# EAGLE design Lampen (EAGLE 9.5.1)
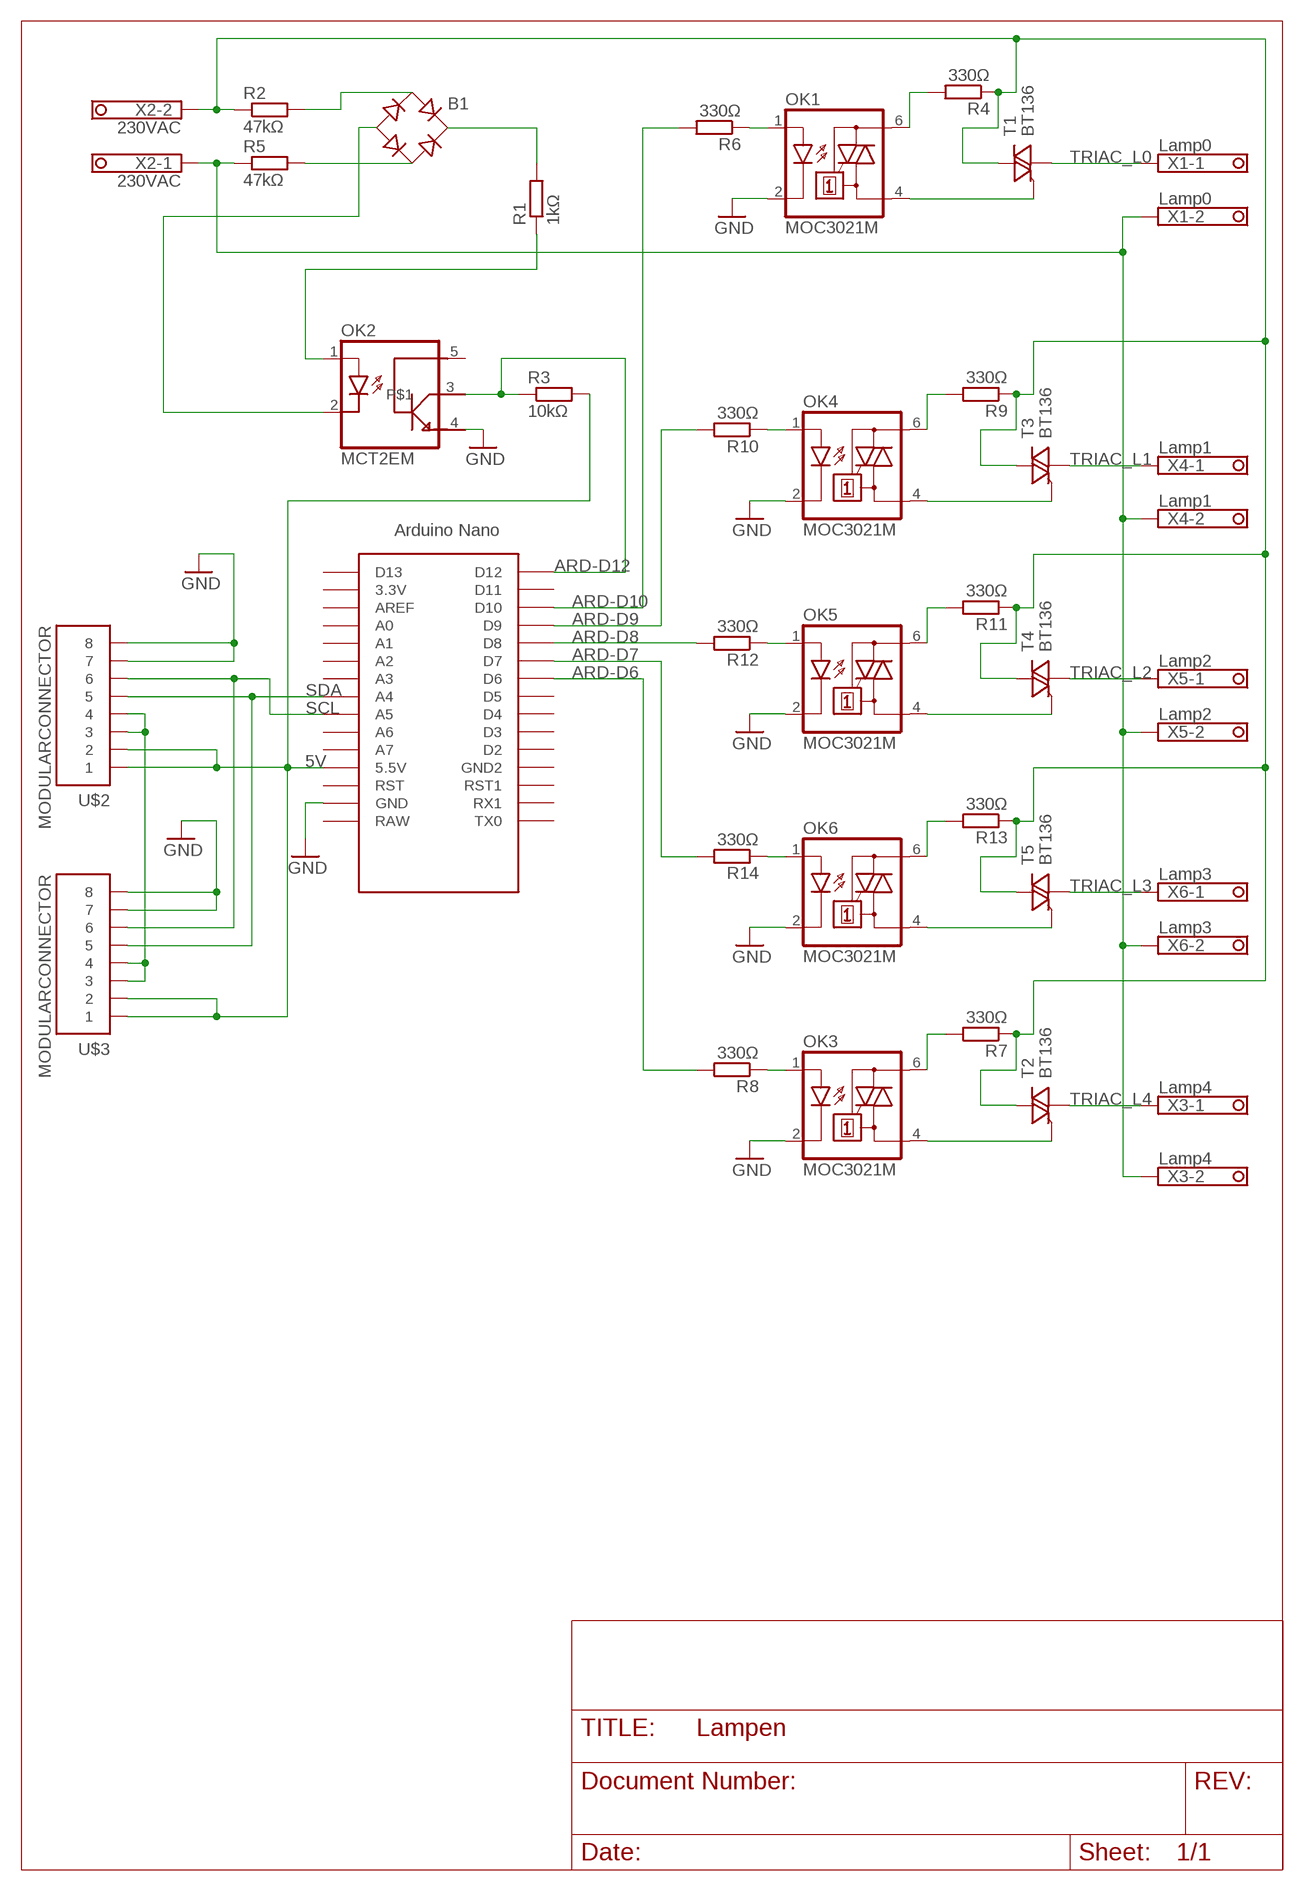
[diagram p0: schematic, sheet 1]

## Parts
B1  B250C1500G  [RB1A]
OK1  MOC3021M  MOC3021M10  [DIL06]
OK2  MCT2EM  MCT2EM21  [DIL06]
OK3  MOC3021M  MOC3021M10  [DIL06]
OK4  MOC3021M  MOC3021M10  [DIL06]
OK5  MOC3021M  MOC3021M10  [DIL06]
OK6  MOC3021M  MOC3021M10  [DIL06]
R1  1kΩ  R-EU_M1206  [M1206]
R2  47kΩ  R-EU_R2512  [R2512]
R3  10kΩ  R-EU_M1206  [M1206]
R4  330Ω  R-EU_M1206  [M1206]
R5  47kΩ  R-EU_R2512  [R2512]
R6  330Ω  R-EU_M1206  [M1206]
R7  330Ω  R-EU_M1206  [M1206]
R8  330Ω  R-EU_M1206  [M1206]
R9  330Ω  R-EU_M1206  [M1206]
R10  330Ω  R-EU_M1206  [M1206]
R11  330Ω  R-EU_M1206  [M1206]
R12  330Ω  R-EU_M1206  [M1206]
R13  330Ω  R-EU_M1206  [M1206]
R14  330Ω  R-EU_M1206  [M1206]
T1  BT136  [TO220DS]
T2  BT136  [TO220DS]
T3  BT136  [TO220DS]
T4  BT136  [TO220DS]
T5  BT136  [TO220DS]
U$1  NANO  [NANO]
U$2  MODULARCONNECTOR  [MA04-2]
U$3  MODULARCONNECTOR  [MA04-2]
X1  Lamp0  1751248  [1751248]
X2  230VAC  1751248  [1751248]
X3  Lamp4  1751248  [1751248]
X4  Lamp1  1751248  [1751248]
X5  Lamp2  1751248  [1751248]
X6  Lamp3  1751248  [1751248]

## Nets
3.3V: U$2.3 U$2.4 U$3.3 U$3.4
5V: R3.2 U$1.5V(5.5V) U$2.1 U$2.2 U$3.1 U$3.2
230VL: R2.1 R4.1 R7.1 R9.1 R11.1 R13.1 T1.A2 T2.A2 T3.A2 T4.A2 T5.A2 X2.2
230VN: R5.1 X1.2 X2.1 X3.2 X4.2 X5.2 X6.2
ARD-D6: R8.2 U$1.D6
ARD-D7: R14.2 U$1.D7
ARD-D8: R12.2 U$1.D8
ARD-D9: R10.2 U$1.D9
ARD-D10: R6.2 U$1.D10
ARD-D12: OK2.3 R3.1 U$1.D12
GND: OK1.2(C) OK2.4(A1) OK3.2(C) OK4.2(C) OK5.2(C) OK6.2(C) U$1.GND U$2.7 U$2.8 U$3.7 U$3.8
N$1: B1.AC2 R5.2
N$3: B1.+ R1.2
N$4: OK2.1(A) R1.1
N$5: B1.AC1 R2.2
N$6: OK1.1(A) R6.1
N$7: B1.- OK2.2(C)
N$10: OK1.4(A1) T1.G
N$13: OK1.6(A2) R4.2
N$15: OK4.4(A1) T3.G
N$16: OK3.4(A1) T2.G
N$19: OK3.6(A2) R7.2
N$20: OK3.1(A) R8.1
N$24: OK4.6(A2) R9.2
N$25: OK4.1(A) R10.1
N$27: OK5.4(A1) T4.G
N$30: OK5.6(A2) R11.2
N$31: OK5.1(A) R12.1
N$33: OK6.4(A1) T5.G
N$36: OK6.6(A2) R13.2
N$37: OK6.1(A) R14.1
SCL: U$1.A5 U$2.6 U$3.6
SDA: U$1.A4 U$2.5 U$3.5
TRIAC_L0: T1.A1 X1.1
TRIAC_L1: T3.A1 X4.1
TRIAC_L2: T4.A1 X5.1
TRIAC_L3: T5.A1 X6.1
TRIAC_L4: T2.A1 X3.1
Unconnected: OK2.5(A2) U$1.3.3V U$1.A0 U$1.A1 U$1.A2 U$1.A3 U$1.A6 U$1.A7 U$1.AREF U$1.D2 U$1.D3 U$1.D4 U$1.D5 U$1.D11 U$1.D13 U$1.GND1(GND2) U$1.ICSP1 U$1.ICSP2 U$1.ICSP3 U$1.ICSP4 U$1.ICSP5 U$1.ICSP6 U$1.RAW U$1.RST U$1.RST1 U$1.RX1 U$1.TX0

## Library data of the parts
B1 = dimmer_lampen:B250C1500G: RECTIFIER 1 A
OK1 OK3-OK6 = dimmer_lampen:MOC3021M: RANDOM-PHASE OPTOISOLATORS TRIAC DRIVER OUTPUT Source: http://www.fairchildsemi.com MOC3020-M.pdf; MF: FAIRCHILD SEMICONDUCTOR; MPN: MOC3010-M; OC_FARNELL: 1505423; OC_NEWARK: 72K8892
OK2 = dimmer_lampen2:MCT2EM: RANDOM-PHASE OPTOISOLATORS TRIAC DRIVER OUTPUT; MF: FAIRCHILD SEMICONDUCTOR; MPN: MOC3021-M; OC_FARNELL: 1021365; OC_NEWARK: 95B7895
R1-R14 = rcl:R-EU_: RESISTOR, European symbol; SPICEPREFIX: R
T1-T5 = dimmer_lampen:BT136: TRIAC
U$1 = Arduino-clone:NANO: Arduino Nano
U$2 U$3 = Main_lib:MODULARCONNECTOR
X1-X6 = dimmer_lampen:1751248: MKDS 1/ 2-3,5 Printklemme Nennstrom: 10 A Bemessungsspannung: 160 V Raster: 3,5 mm Polzahl: 2 Montageart: Löten Anschlussart: Schraubanschluss Anschlussrichtung vom Leiter zur Platine: 0° Source: http://eshop.phoenixcontact.com .. 1751248.pdf

## Board
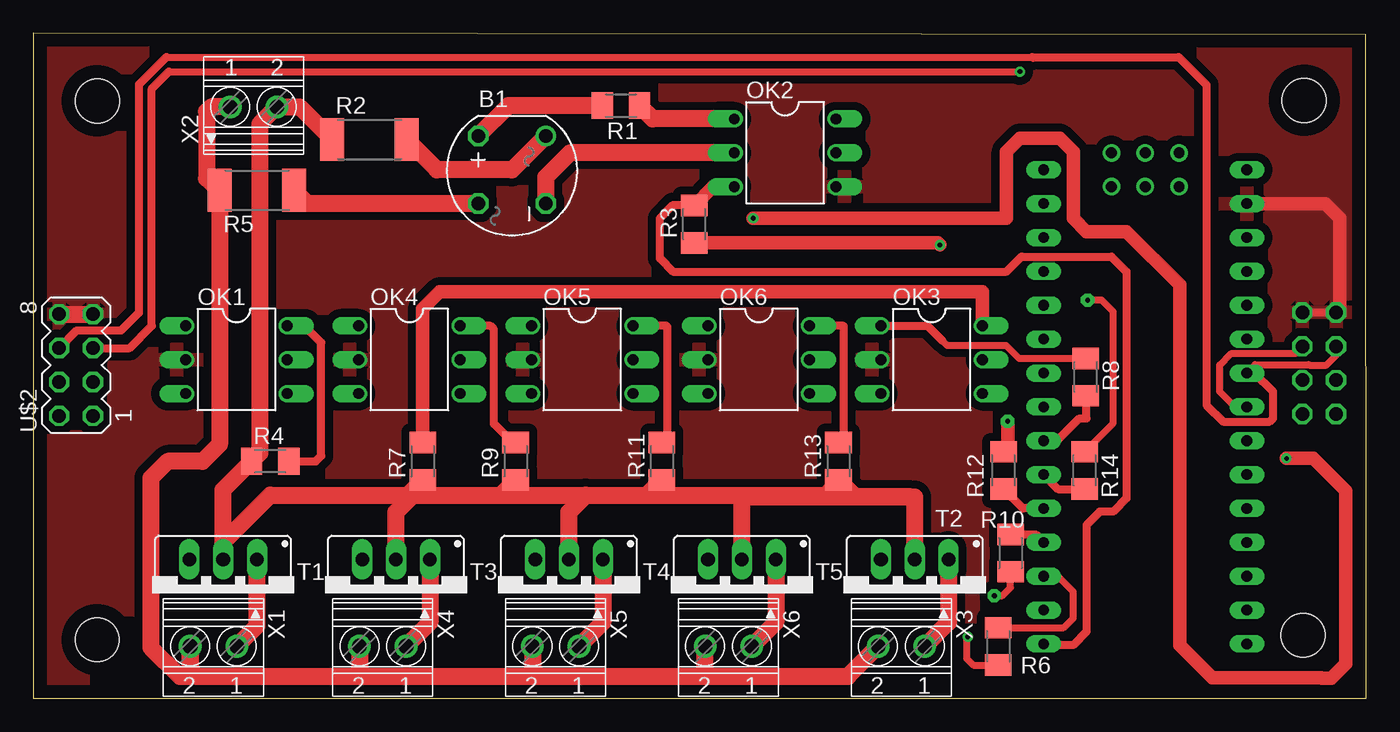
[diagram p1: board, top side]
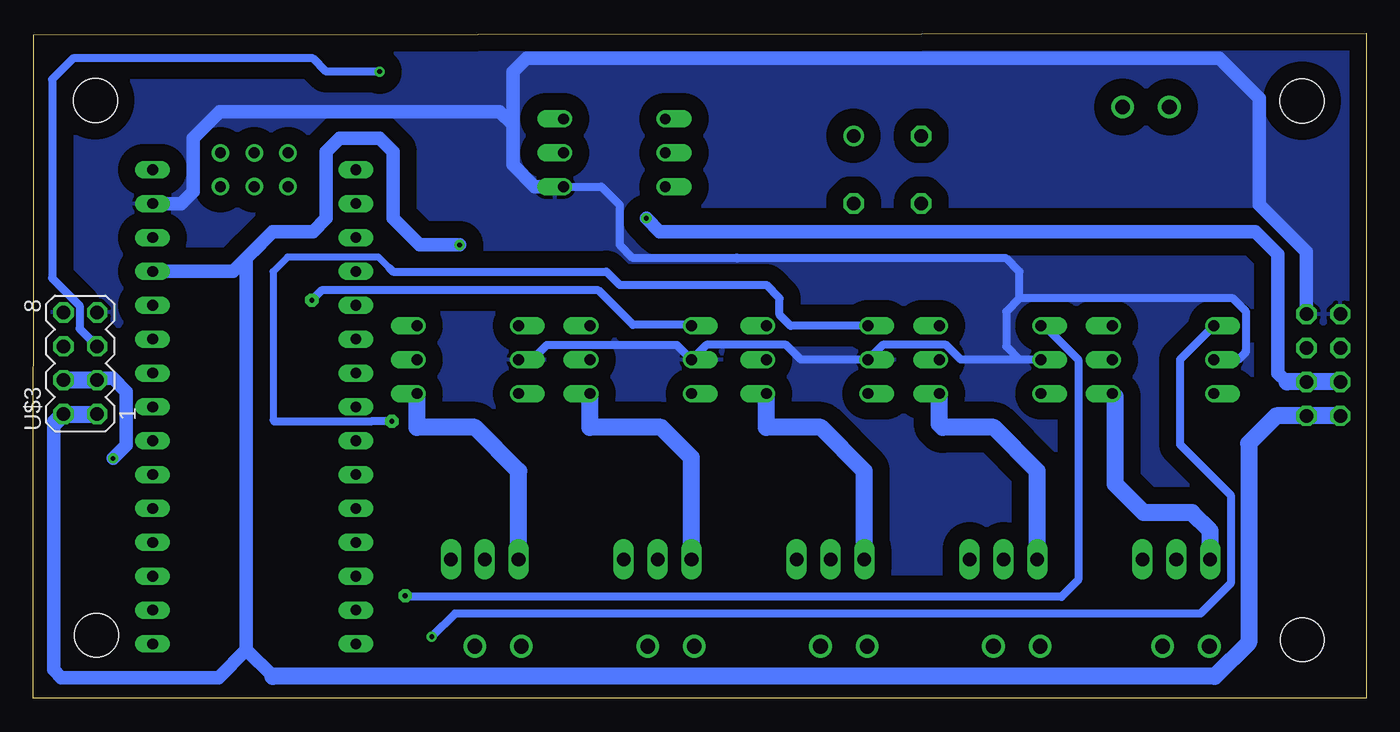
[diagram p2: board, bottom side, seen from below]

Size 99.98 x 49.87 mm. Coordinates in mm from the lower left corner, seen from the top.
Outline: 0,0 99.98,0 99.95,49.77 0,49.87 0,0
Copper layers (1+16): Top 0.035mm / dielectric 1.5mm / Bottom 0.035mm
Design rules "default *": minimum track width 6mil, minimum drill 0.35mm, track to track 6mil, track to pad 6mil, pad to pad 6mil, via to via 6mil, smd to smd 6mil, copper to edge 40mil, drill to drill 6mil, minimum pad ring 10mil, minimum via ring 8mil, stop-mask expansion 4mil, vias tented up to drill 0mil, thermal gap 10mil
Holes 3.3 mm at 4.81,44.8 4.8,4.4 95.23,4.74 95.33,44.84

### Footprints (pad centres in the part's own frame; a part is rotated, then mirrored left to right if it is on the bottom)
RB1A = drill 1.016 octagon: + -2.54,-2.54; - 2.54,2.54; AC2 2.54,-2.54 | drill 1.016: AC1 -2.54,2.54
DIL06 = drill 0.813 offset: 1 -2.54,-3.81; 2 0,-3.81; 3 2.54,-3.81; 4 2.54,3.81; 5 0,3.81; 6 -2.54,3.81
M1206 = smd 1.6 x 2: 1 -1.4,0; 2 1.4,0
R2512 = smd 1.8 x 3.2: 1 -2.8,0; 2 2.8,0
TO220DS = drill 1.016 long: A1 -2.54,-2.54; A2 0,-2.54; G 2.54,-2.54
NANO = drill 0.8 long: 3.3V -10.16,24.13; 5V -10.16,-1.27; A0 -10.16,19.05; A1 -10.16,16.51; A2 -10.16,13.97; A3 -10.16,11.43; A4 -10.16,8.89; A5 -10.16,6.35; A6 -10.16,3.81; A7 -10.16,1.27; AREF -10.16,21.59; D2 5.08,1.27; D3 5.08,3.81; D4 5.08,6.35; D5 5.08,8.89; D6 5.08,11.43; D7 5.08,13.97; D8 5.08,16.51; D9 5.08,19.05; D10 5.08,21.59; D11 5.08,24.13; D12 5.08,26.67; D13 -10.16,26.67; GND -10.16,-6.35; GND1 5.08,-1.27; RAW -10.16,-8.89; RST -10.16,-3.81; RST1 5.08,-3.81; RX1 5.08,-6.35; TX0 5.08,-8.89 | drill 0.8: ICSP1 -5.08,-10.16; ICSP2 -5.08,-7.62; ICSP3 -2.54,-10.16; ICSP4 -2.54,-7.62; ICSP5 0,-10.16; ICSP6 0,-7.62
MA04-2 = drill 1.016 octagon: 1 -3.81,-1.27; 2 -3.81,1.27; 3 -1.27,-1.27; 4 -1.27,1.27; 5 1.27,-1.27; 6 1.27,1.27; 7 3.81,-1.27; 8 3.81,1.27
1751248 = drill 1.1 pad 1.7: 1 -1.75,-0.1; 2 1.75,-0.1

### Placement (x,y rotation side)
B1  35.91,39.64 270 top
OK1  15.24,25.4 270 top
OK2  56.39,40.91 270 top
OK3  67.39,25.4 270 top
OK4  28.21,25.4 270 top
OK5  41.18,25.4 270 top
OK6  54.42,25.4 270 top
R1  44.07,44.45 180 top
R2  25.21,41.91 0 top
R3  49.58,35.56 270 top
R4  17.78,17.78 0 top
R5  16.78,38.1 0 top
R6  72.38,3.9 90 top
R7  29.21,17.78 90 top
R8  78.94,24.1 270 top
R9  36.18,17.78 90 top
R10  73.3,10.9 90 top
R11  47.15,17.78 90 top
R12  72.78,17.1 270 top
R13  60.39,17.78 90 top
R14  78.86,17.1 270 top
T1  14.24,7.89 180 top
T2  66.12,7.89 180 top
T3  27.21,7.89 180 top
T4  40.18,7.89 180 top
T5  53.15,7.89 180 top
U$1  80.87,30.75 180 top
U$2  3.21,25 90 top
U$3  96.46,25.13 90 bottom
X1  13.51,3.81 180 top
X2  16.51,44.45 0 top
X3  65.12,3.81 180 top
X4  26.21,3.81 180 top
X5  39.18,3.81 180 top
X6  52.15,3.81 180 top

### Tracks (layer width: path | path; a pad name or v marks a point on that pad's centre or on a via)
3.3V  (via drill 0.35)
  Top 1: 88.45,1.55 96.6,1.55 96.63,1.52 97.37,1.52 98.46,2.61 98.46,6.24 98.45,15.54 98.4,15.6
  Top 1.016: v54,36 73,36 73,41 74,42 77,42 78,41 78,36 79,35 82,35 86,31 86,4 88.45,1.55 | 98.4,15.6 96,18 v94,18
  Bottom 1.016: 5.95,23.73 6.62,24.4 6.62,33.29 8.33,35 53,35 v54,36 | v94,18 93,19 93,23 94,24 95.05,24 U$3.3
  Bottom 1.27: U$2.4 U$2.3 5.95,23.73 | U$3.3 U$3.4
5V  (via drill 0.35)
  Top 0.61: 49.45,34.29 R3.2
  Top 1.016: 50.11,34.16 R3.2 67.84,34.16 v68,34
  Bottom 0.61: 83,34.02 82.98,34.02
  Bottom 1: 84,3.65 86.09,1.56 97.89,1.56 97.89,1.57 98.46,2.13 98.45,20.45 97.73,21.18 U$3.2
  Bottom 1.016: 82,1.65 84,3.65 84,33 82.98,34.02 | U$1.5V 85,32.02 83,34.02 82.02,35 79,35 78,36 78,41 77,42 74,42 73,41 73,36 71,34 v68,34
  Bottom 1.27: U$2.2 U$2.1 6.75,21.19 8.82,19.12 8.82,4.19 11.36,1.65 82,1.65 | 98.32,20.73 U$3.2 U$3.1
230VL
  Top 1.016: R13.1 59.69,15.68 59.69,15.11
  Top 1.27: R2.1 19.97,44.35 X2.2 16.99,43.08 16.99,18.39 R4.1 14.24,15.64 T1.A2 14.24,11.7 17.78,15.24 28.07,15.24 | R7.1 28.07,15.24 | 28.07,15.24 28.48,15.24 | 59.69,15.11 53.42,15.11 53.15,14.84 T5.A2 | 59.69,15.11 66.12,15.11 T2.A2 | R13.1 61.66,15.11 65.85,15.11 | T3.A2 27.21,13.97 28.48,15.24 | 28.48,15.24 35.04,15.24 | 35.04,15.24 R9.1 | 35.04,15.24 41.45,15.24 | 41.45,15.24 46.01,15.24 | 46.01,15.24 59.56,15.24 59.69,15.11 | 46.01,15.24 R11.1 | T4.A2 40.18,13.97 41.45,15.24
230VN
  Top 1.27: 24.46,1.65 12.24,1.65 11.76,2.13 X1.2 11.76,1.65 10.98,1.65 8.82,3.81 8.82,16.51 10.09,17.78 12.7,17.78 13.97,19.05 R5.1 | X4.2 24.46,1.65 | 37.91,1.65 37.43,2.13 X5.2 | 50.4,1.65 61.11,1.65 X3.2 | 50.4,1.65 X6.2 | R5.1 | X2.1 13.35,44.35 13,44 13,39 13.91,38.09 R5.1 | 37.91,1.65 50.4,1.65 | 24.46,1.65 37.91,1.65
ARD-D6
  Top 0.61: U$1.D6 76.79,19.32 78.47,21 79,21 79,22.64 R8.2
ARD-D7
  Top 0.61: U$1.D7 76.87,15.7 R14.2
ARD-D8
  Top 0.61: U$1.D8 74.24,14.24 R12.2
ARD-D9
  Top 0.61: R10.2 75.19,12.3 U$1.D9
ARD-D10
  Top 0.508: R6.2 77.3,5.3 78,6 78,8 76.84,9.16 U$1.D10
ARD-D12
  Top 0.61: R3.1 49.54,37 48,37 47,36 47,33 48,32 73,32 74.13,33.13 80.87,33.13 82,32 82,15 81,14 80,14 79,13 79,5 78,4 75.87,4 U$1.D12
  Top 1.016: OK2.3 50.99,38.37 R3.1
GND
  Top 0.61: U$3.7 U$3.8
  Top 1.016: U$3.8 98,29.21 98,36 96.9,37.1 U$1.GND
  Top 1.27: U$2.8 U$2.7
  Bottom 0.61: OK4.2 26,25.4 | 26,25.4 30.4,25.4 31.52,26.52 36.25,26.52 OK5.2 42.4,25.4 43.52,26.52 49.49,26.52 OK6.2 51.73,26.52 61.46,26.52 62.58,25.4 OK3.2 | OK1.2 9.6,25.4 8.99,26.01 8.99,28.99 10,30 26,30 | 26,30 27,29 27,26.4 26,25.4 | 26,30 26,32 27,33 47.16,33 47.21,33.05 55.05,33.05 56,34 56,37 57.37,38.37 OK2.4 60.2,38.2
  Bottom 1.016: U$2.7 4.48,33.48 8,37 8,45 11,48 63,48 64,47 64,43 | OK2.4 62.37,38.37 64,40 64,43 | U$1.GND 88.9,37.1 88,38 88,42 86,44 65,44 64,43
  pour Bottom (isolate 1.27): 0,49.53 100,49.53 100,0 0,0
  pour Top (isolate 0.61): 0,49.53 100,49.53 100,0 0,0
N$1
  Top 1.27: B1.AC2 20.58,37.1 R5.2
N$3
  Top 1.27: R1.2 35.64,44.45 B1.+
N$4
  Top 1.27: OK2.1 46.47,43.45 R1.1
N$5
  Top 1.27: R2.2 30.28,39.64 35.91,39.64 B1.AC1
N$6  (via drill 0.35)
  Top 0.508: v70.09,4.62 70,4.53 70,3 70.5,2.5 R6.1
  Bottom 0.61: OK1.1 13.97,25.4 13.97,19.05 10.16,15.24 10.16,8.62 12.43,6.35 68.36,6.35 v70.09,4.62
N$7
  Top 1.27: B1.- 38.45,39.1 40.26,40.91 OK2.2
N$10
  Bottom 1.27: T1.G 11.7,12.57 13.07,13.93 16.69,13.93 18.82,16.07 18.82,22.63 OK1.4
N$13
  Top 0.61: R4.2 21.18,17.78 21.59,18.19 21.59,26.67 20.32,27.94
  Top 1.016: 20.32,27.94 OK1.6
N$15
  Bottom 1.27: T3.G 24.67,17.05 27.94,20.32 31.75,20.32 32.02,20.59 OK4.4
N$16
  Bottom 1.27: T2.G 63.58,17.05 66.85,20.32 71.2,20.32 OK3.4
N$19
  Top 1.016: R7.2 29.21,29.21 30.48,30.48 71.2,30.48 OK3.6
N$20
  Top 0.508: R8.1 73.93,25.5 72.96,26.47 68.53,26.47 68.18,26.82
  Top 0.61: OK3.1 67.06,27.94 68.18,26.82
N$24
  Top 0.152: R9.2 36.05,19.05
  Top 0.61: OK4.6 34.29,27.94 34.56,27.67 34.56,20.59 35.97,19.18 R9.2
N$25  (via drill 0.35 pad 1)
  Top 0.508: v72.09,7.7 72.7,7.7 73.3,8.3 R10.1
  Bottom 0.61: OK4.1 24.13,27.94 21.59,25.4 21.59,8.89 22.86,7.62 72.09,7.62 v72.09,7.7
N$27
  Bottom 1.27: T4.G 37.64,17.05 40.91,20.32 44.99,20.32 OK5.4
N$30
  Top 0.61: R11.2 47.53,19.56 47.53,27.94 OK5.6
N$31  (via drill 0.35 pad 1)
  Top 1.016: R12.1 73.09,18.81 v73.09,20.78
  Bottom 0.508: 81.9,20.78 82,20.88 82,32 80.92,33.08 74.08,33.08 73.29,32.29
  Bottom 0.61: OK5.1 43.18,27.94 44,28.76 44,30 45,31 56,31 57,32 73,32 73.29,32.29 | v73.09,20.78 74.64,20.78 74.68,20.75 81.87,20.75 81.9,20.78
N$33
  Bottom 1.27: T5.G 50.61,18.05 52.88,20.32 58.23,20.32 OK6.4
N$36
  Top 0.61: R13.2 60.77,19.56 60.77,27.94 OK6.6
N$37  (via drill 0.35 pad 1)
  Top 0.508: R14.1 81,20.64 81,29 80.14,29.86 v79.09,29.86
  Bottom 0.61: v79.09,29.86 78.36,30.59 57.59,30.59 55,28 50.67,28 OK6.1
SCL
  Top 0.508: U$1.A5 91.66,25.03 95.67,25.03 95.7,25 97,25 97.73,25.73 U$3.6 | 9.98,48.08 74.92,48.08 75,48
  Top 0.61: 9.98,48.08 7.92,46.02 7.92,28.92 6.59,27.59 3.26,27.59 U$2.6 | 74.92,48.08 85.92,48.08 88,46 88,22 89.25,20.75 92.75,20.75 93,21 93,23 91.6,24.4 U$1.A5
SDA  (via drill 0.35)
  Top 0.508: U$1.A4 90.14,21.86 89,23 89,25 89.88,25.88 94.67,25.88 U$3.5 | 10.16,46.99 10.17,47 v74,47
  Top 0.61: U$2.5 7.22,26.27 8.89,27.94 8.89,45.72 10.16,46.99
  Bottom 0.61: v74,47 78,47 79,48 97,48 98.58,46.42 98.58,31.51 96.51,29.45 96.51,27.72 U$3.5
TRIAC_L0
  Top 1.27: X1.1 16.78,5.43 T1.A1
TRIAC_L1
  Top 1.27: T3.A1 29.75,5.7 X4.1
TRIAC_L2
  Top 1.27: T4.A1 42.72,5.7 X5.1
TRIAC_L3
  Top 1.27: T5.A1 55.69,5.7 X6.1
TRIAC_L4
  Top 1.27: T2.A1 68.66,5.7 X3.1